# Altium schematic sheet Sheet1.SchDoc
size A4
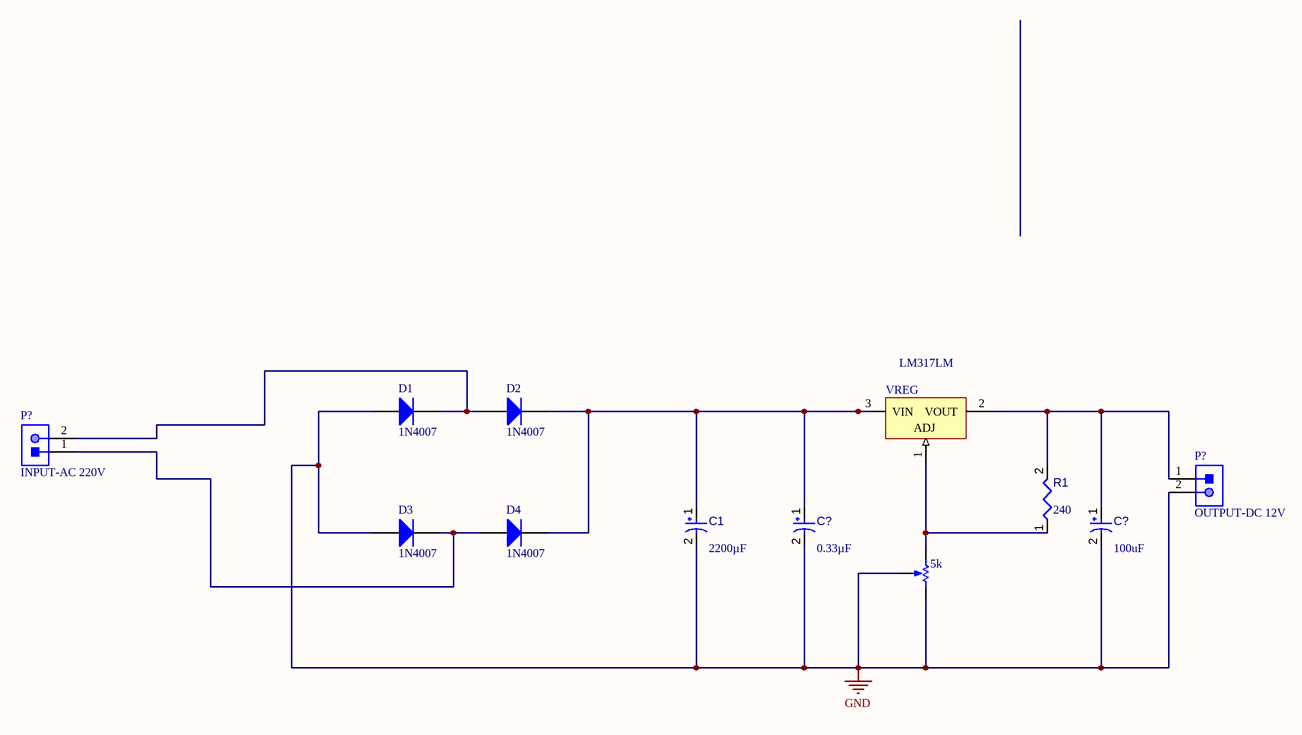
[diagram p0: Sheet1.SchDoc]

## Parts
(Parts that share a designator on the sheet are numbered #1, #2 ... from top to bottom, then left to right.)
5k  3296W-1-103LF  [BOUR-3296W]  (value not drawn)
C1  value 2200µF  [VISH-7343-31_N]  (hidden comment: 293D476X9016D2TE3)
C?#1  value 0.33µF  [VISH-7343-31_N]  (hidden comment: 293D476X9016D2TE3)
C?#2  value 100uF  [VISH-7343-31_N]  (hidden comment: 293D476X9016D2TE3)
D1  1N4007  [FAIR-DO-41-2]
D2  1N4007  [FAIR-DO-41-2]
D3  1N4007  [FAIR-DO-41-2]
D4  1N4007  [FAIR-DO-41-2]
P?#1  INPUT-AC 220V  [JST-B2P-VH(LF)(SN)_V]
P?#2  OUTPUT-DC 12V  [JST-B2P-VH(LF)(SN)_V]
R1  value 240  [RESC0402(1005)_L]  (hidden comment: Resistor 240R +/-5 % 0402 63 mW)
VREG  LM317LM  [ONSC-TO-220-3-221AB-01]

## Nets
GND: 5k.2(S) 5k.3(CW) C1.2 C?#1.2 C?#2.2 D1.2(A) D3.2(A) P?#2.2
Net5k_1: 5k.1(CCW) R1.1 VREG.1(ADJ)
NetC1_1: C1.1 C?#1.1 D2.1(K) D4.1(K) VREG.3(VIN)
NetC?#2_1: C?#2.1 P?#2.1 R1.2 VREG.2(VOUT)
NetD1_1: D1.1(K) D2.2(A) P?#1.2
NetD3_1: D3.1(K) D4.2(A) P?#1.1

## Library data of the parts
5k = CMP-009-00038-2: Square Trimpot(R) Trimming Potentiometer, 10 KOhm, +/- 10%, 0.5 W, -55 to 125 degC, 3-Pin THD, RoHS, Tube; Manufacturer: Bourns; Voltage Rating: 300V; Power: 500mW; Resistance: 10k; Tolerance: 10%; Min Operating Temperature: -55°C; Case/Package: 3296W; Max Operating Temperature: 150°C; Package Reference: 3296W; Mounting Technology: TH; Manufacturer URL: http://www.bourns.com/; Package Quantity: 50; Package Description: 3-Pin Through Hole Device, Body 9.53 x 4.83 mm, Pitch 2.54 mm; Packaging: Rail/Tube; Datasheet URL: http://www.bourns.com/docs/Product-Datasheets/3296.pdf; RoHS Compliant: True; Datasheet Version: May-16
C1 C?#1 C?#2 = CMP-001-00022-7: Solid Tantalum Chip Capacitor, 47 uF, +/- 10%, 16 V, -55 to 125 degC, 2917 (7343 Metric), RoHS, Tape and Reel; Manufacturer: Vishay Semiconductor; Voltage Rating: 16V; Datasheet URL: http://www.vishay.com/docs/40002/293d.pdf; Max Operating Temperature: 125°C; Packaging: TapeandReel; Mounting Technology: SM; Capacitor Type: Tantalum; Tolerance: 10%; Min Operating Temperature: -55°C; Package Reference: 7343-31; RoHS Compliant: Unknown; Manufacturer URL: http://www.vishay.com/; Datasheet Version: Aug-16; Package Description: 2-Pin Surface Mount Device, Body 7.3 x 4.3 mm; Case/Package: 7343-31
D1-D4 = CMP-004-00007-2: General Purpose Rectifier, 1.1 V, 1.0 A, -55 to 175 degC, 2-Pin DO-41, RoHS, Tape and Reel; Manufacturer: Fairchild; Peak Reverse Current: 5uA; Max Surge Current: 30A; Elements: 1; Forward Voltage: 1.1V; Package Version: Rev. 2, 09/2008; Forward Current: 1A; Package Quantity: 5000; Packaging: TapeandReel; Package URL: http://www.fairchildsemi.com/dwg/DO/DO41A.pdf; Manufacturer URL: https://www.fairchildsemi.com/; Package Reference: DO-41-2; Pins: 2; Min Operating Temperature: -55°C; Datasheet Version: Rev. 1.1.0, 11/2014; Max Operating Temperature: 175°C; RoHS Compliant: True; Case/Package: DO-41-2; Mounting Technology: TH; Package Description: 2-Pin Axial Lead, Dia 2.375 mm, Body Length 4.63 mm; Datasheet URL: https://www.fairchildsemi.com/datasheets/1N/1N4007.pdf
P?#1 P?#2 = CMP-002-00025-2: Male Header, Pitch 3.96 mm, 1 x 2 Position, Height 10.9 mm, Tail Length 3.7 mm, -25 to 85 degC, RoHS, Bulk; Manufacturer: JST; Case/Package: B2P-VH(LF)(SN); Connector Type: Header; Mounting Technology: TH; Package Reference: B2P-VH(LF)(SN); Package Description: Male Header, Pitch 3.96 mm, 1 x 2 Position, Height 10.9 mm, Tail Length 3.7 mm; Max Operating Temperature: 85°C; Manufacturer URL: http://www.jst.com/home2.html; RoHS Compliant: Unknown; Datasheet Version: May-16; Gender: Male; Min Operating Temperature: -25°C; Datasheet URL: http://www.jst-mfg.com/product/pdf/eng/eVH.pdf
R1 = CMP-009-00155-3: Chip Resistor, 240 Ohms, +/-5 %, 63 mW, -55 to 155 degC, 0402; Power: 63mW; Tolerance: 5%; Case/Package: 0402; Pins: 2; Max Operating Temperature: 155°C; Min Operating Temperature: -55°C
VREG = CMP-019-00023-3: Adjustable Output, Positive Voltage Regulator, 1.5 A, 0 to 125 degC, 3-Pin TO-220 (221AB-01), Pb-Free, Rail; Manufacturer: ON Semiconductor; Outputs: 1; Max Input Voltage: 40V; Min Input Voltage: 4.2V; Output Current: 1.5A; Output Voltage: 1.2V; Package Version: Rev. A, 11/2010; Mounting Technology: TH; Case/Package: TO-220; Package Description: 3-Pin Flange Mount, Vertical Straight Lead, Body 9.97 x 4.445 mm, Pitch 2.54 mm; Package Reference: TO-220-3-221AB-01; Manufacturer URL: http://www.onsemi.com/; Package Quantity: 50; Datasheet Version: Rev. 14, 01/2016; Max Ouput Current: 1.5A; Min Operating Temperature: 0°C; Packaging: Rail/Tube; Datasheet URL: http://www.onsemi.com/pub_link/Collateral/LM317-D.PDF; Max Operating Temperature: 125°C; RoHS Compliant: True; Pins: 3